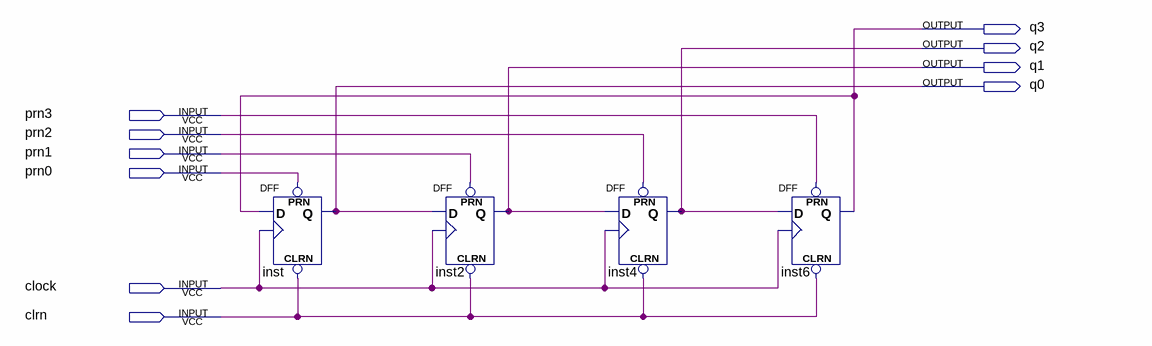
[diagram p0: schematic sheet]
// Quartus schematic mytest4.bdf as structural Verilog: 4 symbols, 10 pins
module mytest4 (
  input  prn3,
  input  prn2,
  input  prn1,
  input  prn0,
  input  clock,
  input  clrn,
  output q3,
  output q2,
  output q1,
  output q0
);

  DFF inst (.CLRN(clrn), .CLK(clock), .D(q3), .PRN(prn0), .Q(q0));
  DFF inst2 (.CLRN(clrn), .CLK(clock), .D(q0), .PRN(prn1), .Q(q1));
  DFF inst4 (.CLRN(clrn), .CLK(clock), .D(q1), .PRN(prn2), .Q(q2));
  DFF inst6 (.CLRN(clrn), .CLK(clock), .D(q2), .PRN(prn3), .Q(q3));
endmodule
